# Altium schematic sheet EEG_4.SchDoc
size A3
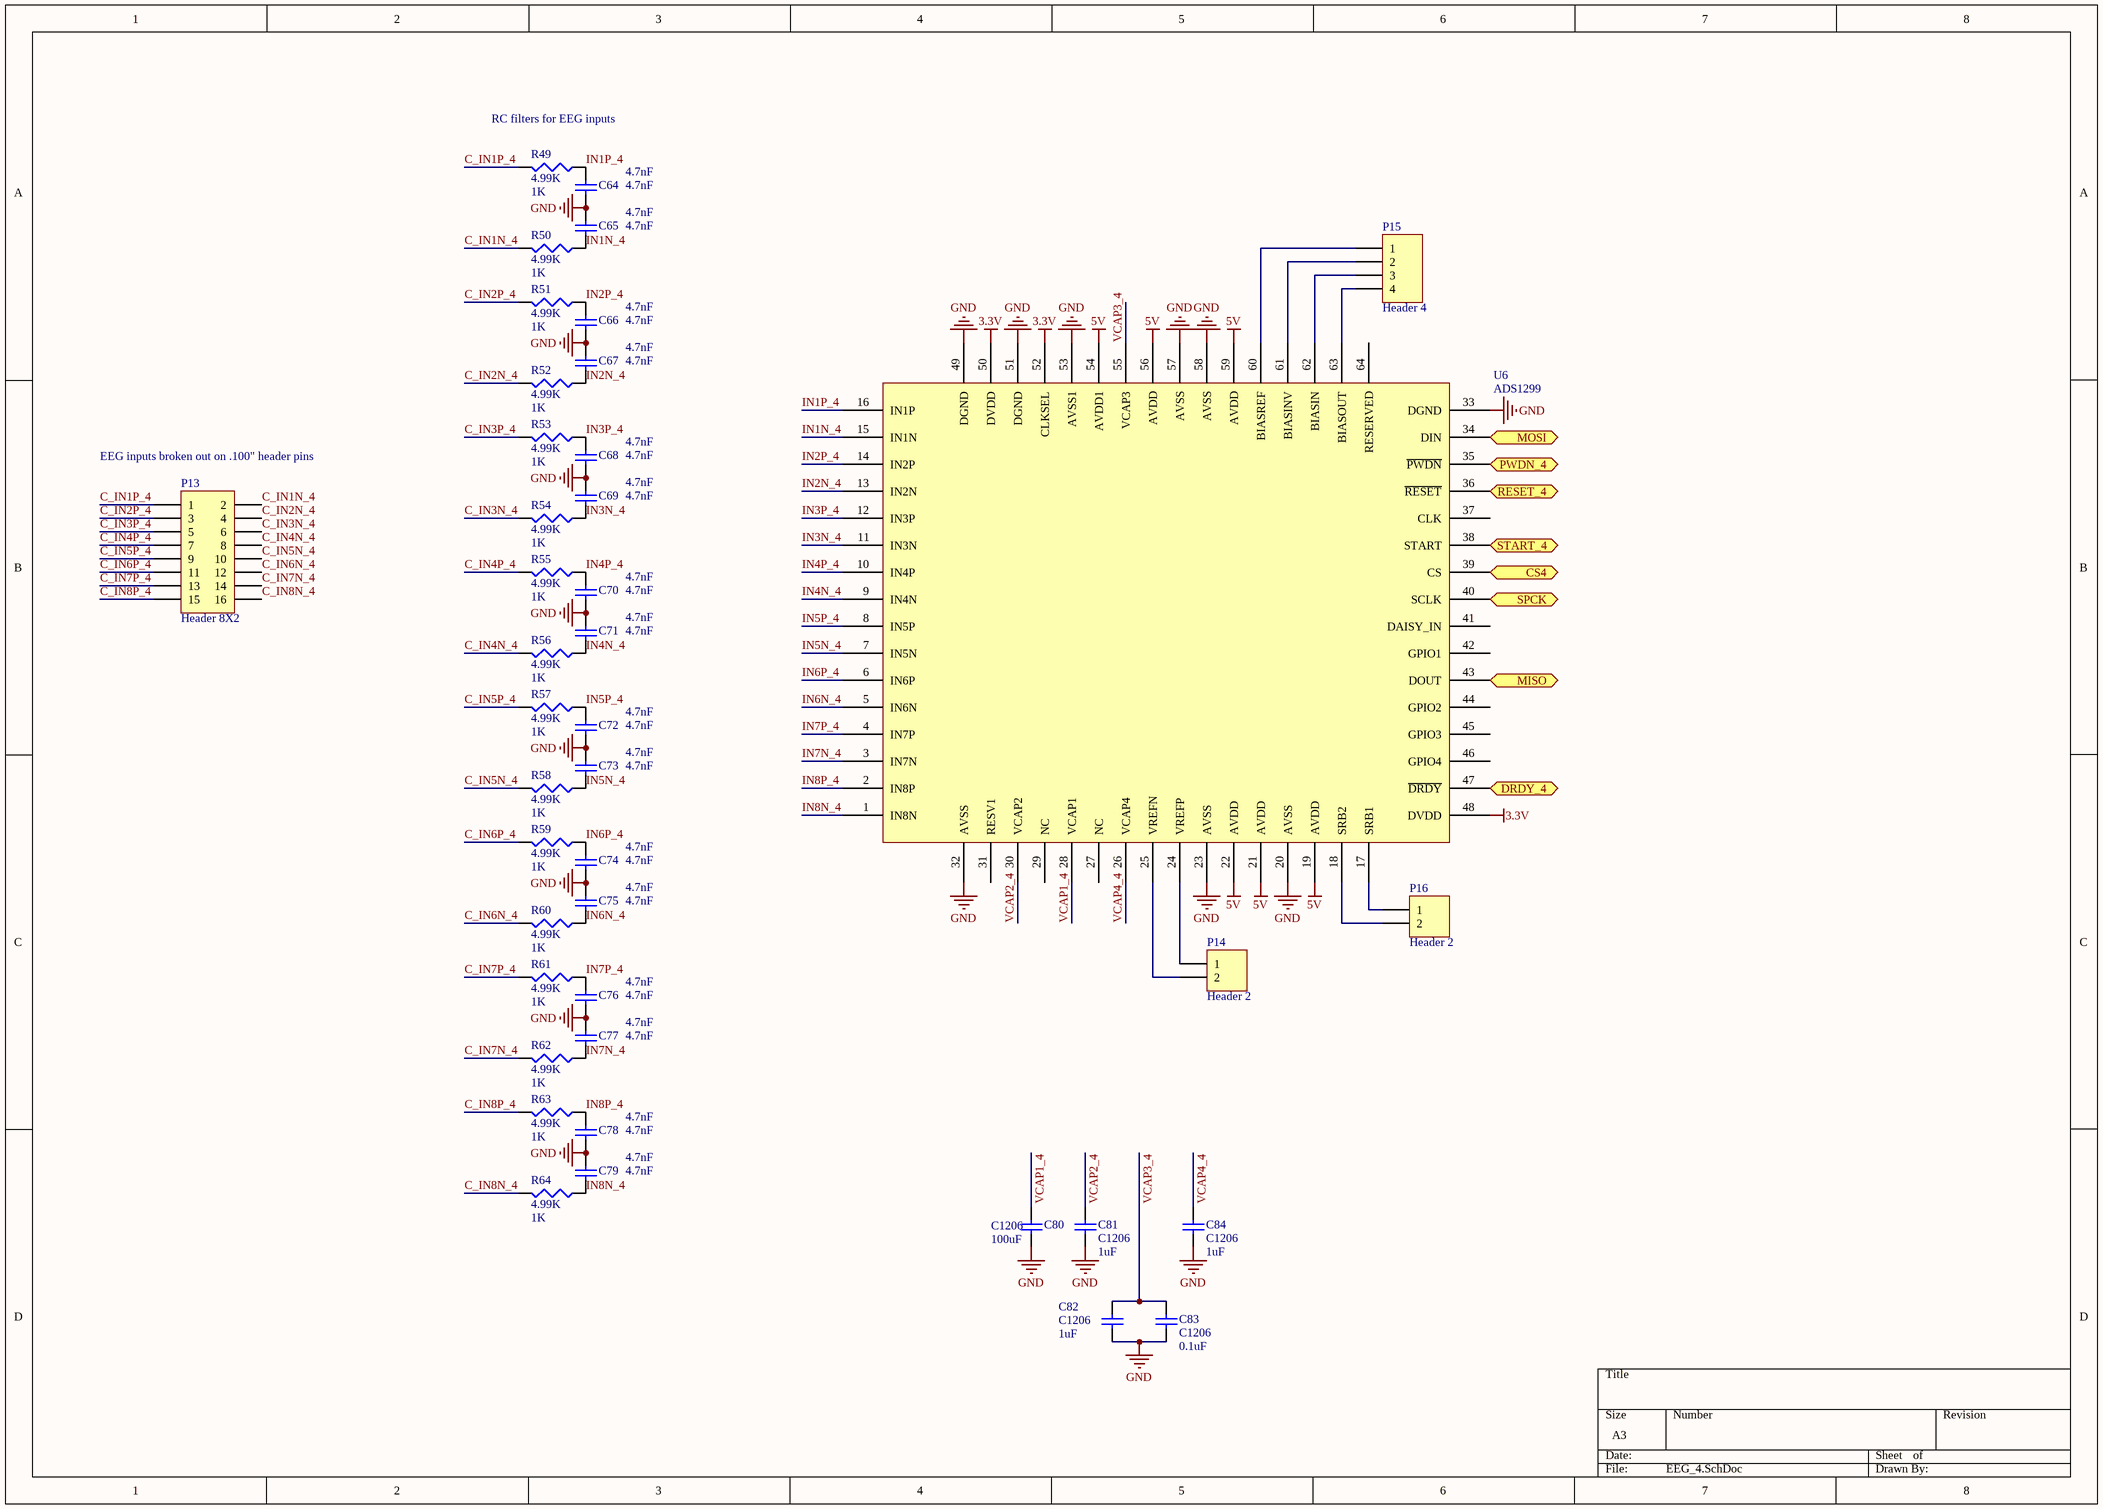
[diagram p0: EEG_4.SchDoc]

## Parts
C64  4.7nF  [1608[0603]]
C65  4.7nF  [1608[0603]]
C66  4.7nF  [1608[0603]]
C67  4.7nF  [1608[0603]]
C68  4.7nF  [1608[0603]]
C69  4.7nF  [1608[0603]]
C70  4.7nF  [1608[0603]]
C71  4.7nF  [1608[0603]]
C72  4.7nF  [1608[0603]]
C73  4.7nF  [1608[0603]]
C74  4.7nF  [1608[0603]]
C75  4.7nF  [1608[0603]]
C76  4.7nF  [1608[0603]]
C77  4.7nF  [1608[0603]]
C78  4.7nF  [1608[0603]]
C79  4.7nF  [1608[0603]]
C80  C1206  value 100uF  [1608[0603]]
C81  C1206  value 1uF  [1608[0603]]
C82  C1206  value 1uF  [1608[0603]]
C83  C1206  value 0.1uF  [1608[0603]]
C84  C1206  value 1uF  [1608[0603]]
P13  Header 8X2  [HDR2X8]
P14  Header 2  [HDR1X2]
P15  Header 4  [HDR1X4]
P16  Header 2  [HDR1X2]
R49  4.99K  value 1K  [1608[0603]]
R50  4.99K  value 1K  [1608[0603]]
R51  4.99K  value 1K  [1608[0603]]
R52  4.99K  value 1K  [1608[0603]]
R53  4.99K  value 1K  [1608[0603]]
R54  4.99K  value 1K  [1608[0603]]
R55  4.99K  value 1K  [1608[0603]]
R56  4.99K  value 1K  [1608[0603]]
R57  4.99K  value 1K  [1608[0603]]
R58  4.99K  value 1K  [1608[0603]]
R59  4.99K  value 1K  [1608[0603]]
R60  4.99K  value 1K  [1608[0603]]
R61  4.99K  value 1K  [1608[0603]]
R62  4.99K  value 1K  [1608[0603]]
R63  4.99K  value 1K  [1608[0603]]
R64  4.99K  value 1K  [1608[0603]]
U6  ADS1299  [ADS1299 Plastic QFP]

## Ports
CS4, DRDY_4, MISO, MOSI, PWDN_4, RESET_4, SPCK, START_4

## Nets
3.3V: U6.48(DVDD) U6.50(DVDD) U6.52(CLKSEL)
5V: U6.19(AVDD) U6.21(AVDD) U6.22(AVDD) U6.54(AVDD1) U6.56(AVDD) U6.59(AVDD)
GND: C64.1 C65.2 C66.1 C67.2 C68.1 C69.2 C70.1 C71.2 C72.1 C73.2 C74.1 C75.2 C76.1 C77.2 C78.1 C79.2 C80.2 C81.1 C82.2 C83.1 C84.1 U6.20(AVSS) U6.23(AVSS) U6.32(AVSS) U6.33(DGND) U6.49(DGND) U6.51(DGND) U6.53(AVSS1) U6.57(AVSS) U6.58(AVSS)
C_IN1N_4: P13.2 R50.2
C_IN1P_4: P13.1 R49.2
C_IN2N_4: P13.4 R52.2
C_IN2P_4: P13.3 R51.2
C_IN3N_4: P13.6 R54.2
C_IN3P_4: P13.5 R53.2
C_IN4N_4: P13.8 R56.2
C_IN4P_4: P13.7 R55.2
C_IN5N_4: P13.10 R58.2
C_IN5P_4: P13.9 R57.2
C_IN6N_4: P13.12 R60.2
C_IN6P_4: P13.11 R59.2
C_IN7N_4: P13.14 R62.2
C_IN7P_4: P13.13 R61.2
C_IN8N_4: P13.16 R64.2
C_IN8P_4: P13.15 R63.2
CS4: U6.39(CS) ; port CS4
DRDY_4: U6.47(~{DRDY}) ; port DRDY_4
IN1N_4: C65.1 R50.1 U6.15(IN1N)
IN1P_4: C64.2 R49.1 U6.16(IN1P)
IN2N_4: C67.1 R52.1 U6.13(IN2N)
IN2P_4: C66.2 R51.1 U6.14(IN2P)
IN3N_4: C69.1 R54.1 U6.11(IN3N)
IN3P_4: C68.2 R53.1 U6.12(IN3P)
IN4N_4: C71.1 R56.1 U6.9(IN4N)
IN4P_4: C70.2 R55.1 U6.10(IN4P)
IN5N_4: C73.1 R58.1 U6.7(IN5N)
IN5P_4: C72.2 R57.1 U6.8(IN5P)
IN6N_4: C75.1 R60.1 U6.5(IN6N)
IN6P_4: C74.2 R59.1 U6.6(IN6P)
IN7N_4: C77.1 R62.1 U6.3(IN7N)
IN7P_4: C76.2 R61.1 U6.4(IN7P)
IN8N_4: C79.1 R64.1 U6.1(IN8N)
IN8P_4: C78.2 R63.1 U6.2(IN8P)
MISO: U6.43(DOUT) ; port MISO
MOSI: U6.34(DIN) ; port MOSI
PWDN_4: U6.35(~{PWDN}) ; port PWDN_4
RESET_4: U6.36(~{RESET}) ; port RESET_4
SPCK: U6.40(SCLK) ; port SPCK
START_4: U6.38(START) ; port START_4
VCAP1_4: C80.1 U6.28(VCAP1)
VCAP2_4: C81.2 U6.30(VCAP2)
VCAP3_4: C82.1 C83.2 U6.55(VCAP3)
VCAP4_4: C84.2 U6.26(VCAP4)
NetP14_1: P14.1 U6.24(VREFP)
NetP14_2: P14.2 U6.25(VREFN)
NetP15_1: P15.1 U6.60(BIASREF)
NetP15_2: P15.2 U6.61(BIASINV)
NetP15_3: P15.3 U6.62(BIASIN)
NetP15_4: P15.4 U6.63(BIASOUT)
NetP16_1: P16.1 U6.17(SRB1)
NetP16_2: P16.2 U6.18(SRB2)

Not connected (* = marked no-connect by the designer): U6 27(NC) 29(NC) 31(RESV1) 37(CLK) 41(DAISY_IN) 42(GPIO1) 44(GPIO2) 45(GPIO3) 46(GPIO4) 64(RESERVED)

## Notes on the sheet
- RC filters for EEG inputs
- (near P13) EEG inputs broken out on .100" header pins

## Library data of the parts
C64-C84 = Cap Semi: Capacitor (Semiconductor SIM Model); Published: 8-Jun-2000; LatestRevisionDate: 29-May-2009; LatestRevisionNote: IPC-7351 Footprint Added.; PackageReference: C1206; Publisher: Altium Limited; PackageDescription: Chip Capacitor
  C64-C79: Value: 4.7nF
P13 = Header 8X2: Header, 8-Pin, Dual row; LatestRevisionDate: 17-Jul-2002; LatestRevisionNote: Re-released for DXP Platform.; Publisher: Altium Limited
P14 P16 = Header 2: Header, 2-Pin; LatestRevisionDate: 17-Jul-2002; LatestRevisionNote: Re-released for DXP Platform.; Publisher: Altium Limited
P15 = Header 4: Header, 4-Pin; LatestRevisionDate: 17-Jul-2002; LatestRevisionNote: Re-released for DXP Platform.; Publisher: Altium Limited
R49-R64 = Res3: Resistor; Published: 8-Jun-2000; LatestRevisionDate: 29-May-2009; LatestRevisionNote: IPC-7351 Footprint Added.; PackageReference: J1-0603; Publisher: Altium Limited; PackageDescription: Chip Resistor